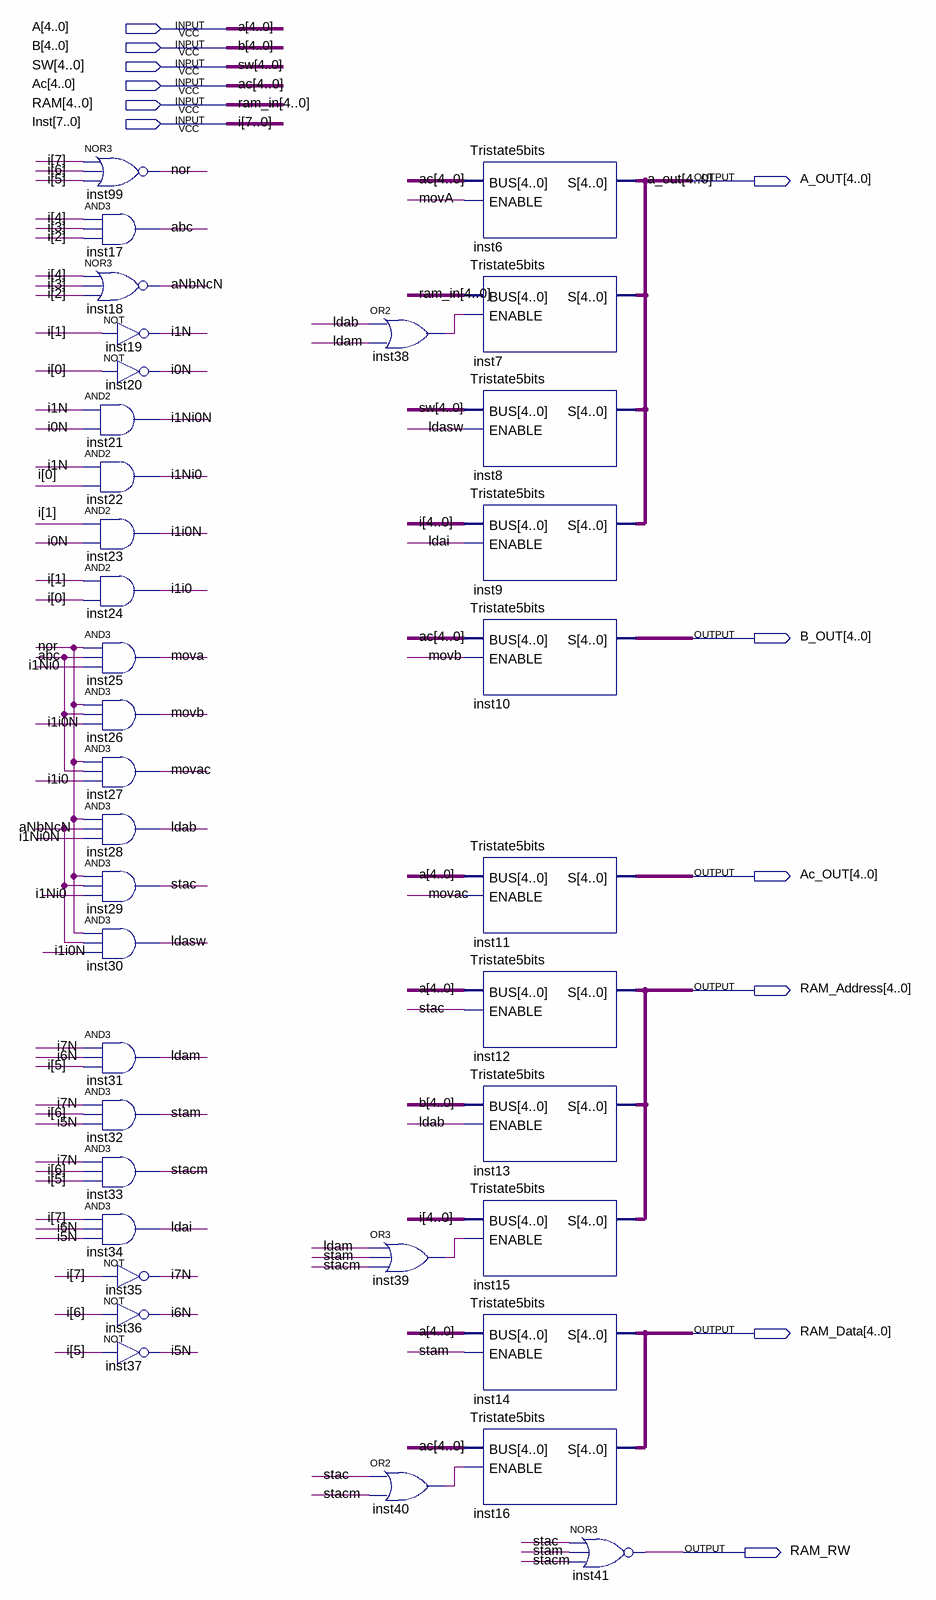
[diagram p0: schematic sheet]
// Quartus schematic Carregamento.bdf as structural Verilog: 37 symbols, 12 pins
module Carregamento (
  input  [4:0] A,
  input  [4:0] B,
  input  [4:0] SW,
  input  [4:0] Ac,
  input  [4:0] RAM,
  input  [7:0] Inst,
  output [4:0] A_OUT,
  output [4:0] B_OUT,
  output [4:0] Ac_OUT,
  output [4:0] RAM_Address,
  output [4:0] RAM_Data,
  output RAM_RW
);

  wire abc, aNbNcN, i0N, i1i0, i1i0N, i1N, i1Ni0, i1Ni0N, i5N, i6N, i7N, inst38_out, inst39_out, inst40_out,
       ldab, ldai, ldam, ldasw, movA, movac, movb, \nor , stac, stacm, stam;

  nor inst99 (\nor , Inst[7], Inst[6], Inst[5]);
  and inst17 (abc, Inst[4], Inst[3], Inst[2]);
  nor inst18 (aNbNcN, Inst[4], Inst[3], Inst[2]);
  and inst21 (i1Ni0N, i1N, i0N);
  and inst22 (i1Ni0, i1N, Inst[0]);
  and inst23 (i1i0N, Inst[1], i0N);
  and inst24 (i1i0, Inst[1], Inst[0]);
  and inst25 (movA, \nor , abc, i1Ni0);
  and inst26 (movb, \nor , abc, i1i0N);
  and inst27 (movac, \nor , abc, i1i0);
  and inst28 (ldab, \nor , aNbNcN, i1Ni0N);
  and inst29 (stac, \nor , aNbNcN, i1Ni0);
  and inst30 (ldasw, \nor , aNbNcN, i1i0N);
  and inst31 (ldam, i7N, i6N, Inst[5]);
  and inst32 (stam, i7N, Inst[6], i5N);
  and inst33 (stacm, i7N, Inst[6], Inst[5]);
  and inst34 (ldai, Inst[7], i6N, i5N);
  not inst19 (i1N, Inst[1]);
  not inst20 (i0N, Inst[0]);
  not inst35 (i7N, Inst[7]);
  not inst36 (i6N, Inst[6]);
  not inst37 (i5N, Inst[5]);
  or inst38 (inst38_out, ldab, ldam);
  or inst39 (inst39_out, ldam, stam, stacm);
  or inst40 (inst40_out, stac, stacm);
  Tristate5bits inst6 (.BUS(Ac), .ENABLE(movA), .S(A_OUT));
  Tristate5bits inst7 (.BUS(RAM), .ENABLE(inst38_out), .S(A_OUT));
  Tristate5bits inst8 (.BUS(SW), .ENABLE(ldasw), .S(A_OUT));
  Tristate5bits inst9 (.BUS(Inst[4:0]), .ENABLE(ldai), .S(A_OUT));
  Tristate5bits inst10 (.BUS(Ac), .ENABLE(movb), .S(B_OUT));
  Tristate5bits inst11 (.BUS(A), .ENABLE(movac), .S(Ac_OUT));
  Tristate5bits inst12 (.BUS(A), .ENABLE(stac), .S(RAM_Address));
  Tristate5bits inst13 (.BUS(B), .ENABLE(ldab), .S(RAM_Address));
  Tristate5bits inst15 (.BUS(Inst[4:0]), .ENABLE(inst39_out), .S(RAM_Address));
  Tristate5bits inst14 (.BUS(A), .ENABLE(stam), .S(RAM_Data));
  Tristate5bits inst16 (.BUS(Ac), .ENABLE(inst40_out), .S(RAM_Data));
  nor inst41 (RAM_RW, stac, stam, stacm);

  // Other names for the same wires on the sheet: i[7:0] = Inst; ram_in[4:0] = RAM
endmodule
